# Altium project NDS_TV_OUT_V1I2.PrjPcb
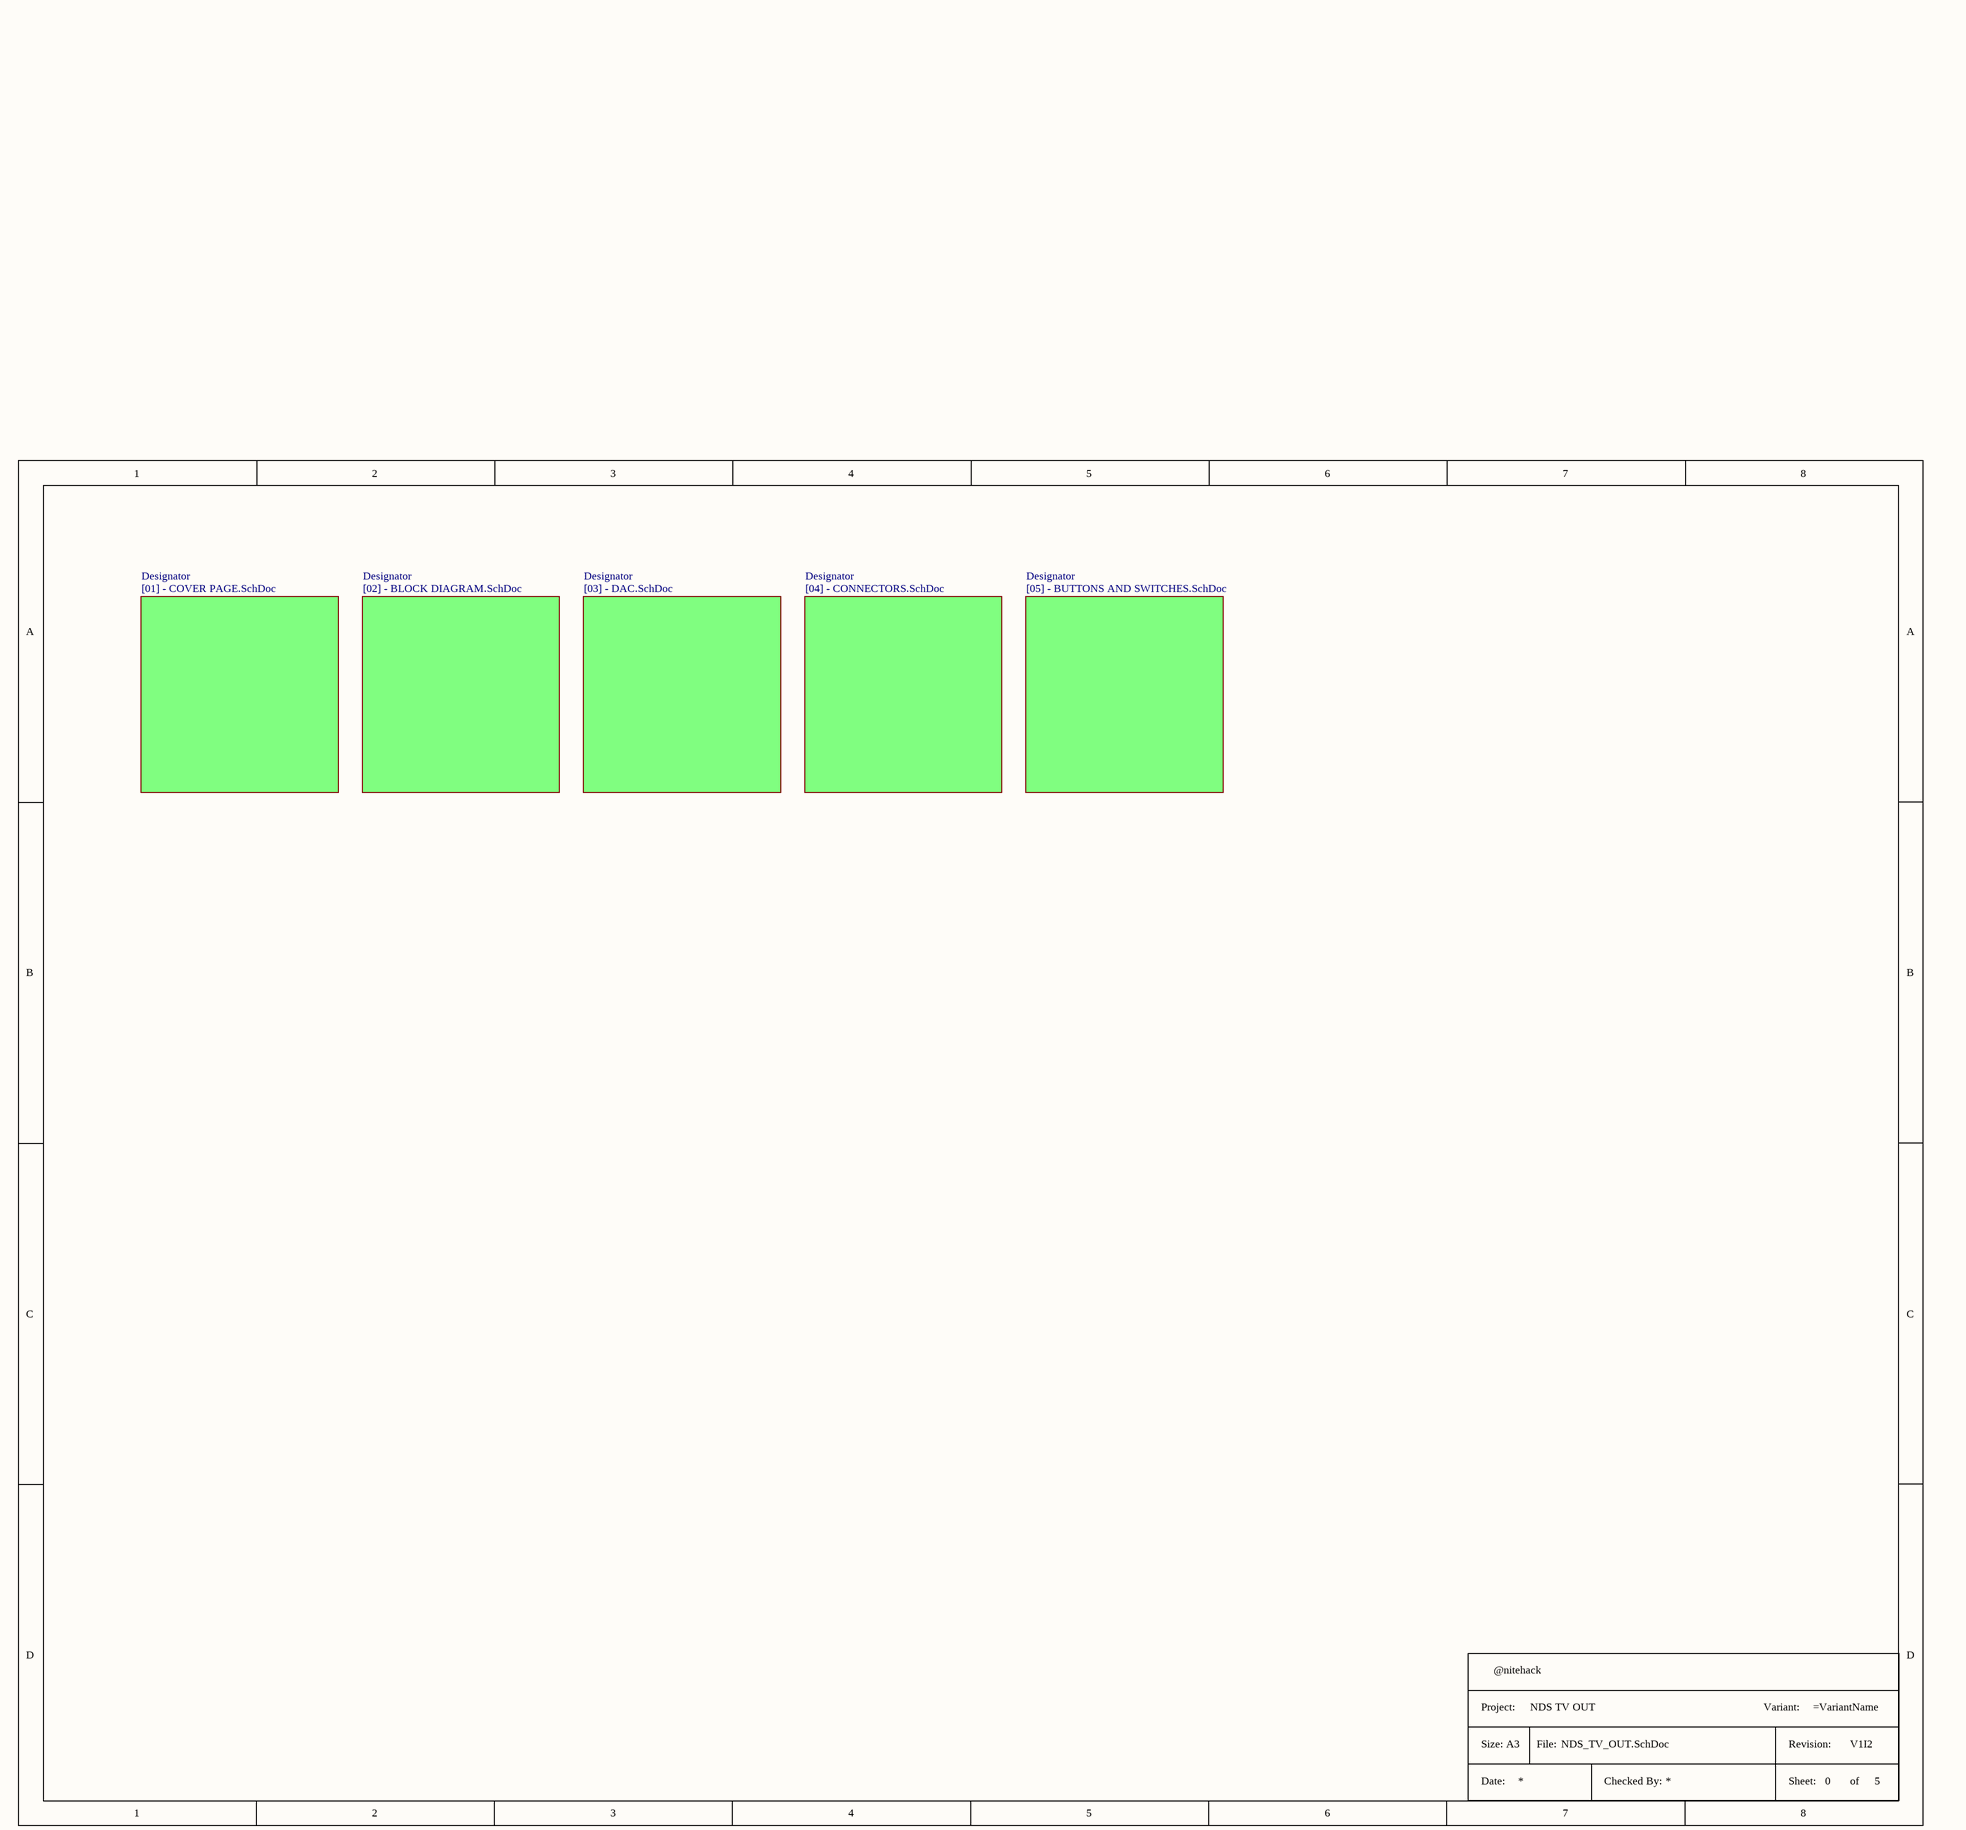
[diagram p0: NDS_TV_OUT.SchDoc]
Year: 2021; VersionRevision: V1I2; Project: NDS TV OUT; Company: @nitehack
6 sheets, 50 parts. Net scope: flat (ports and power ports of the same name join across sheets).
Board file: NDS_TV_OUT_PCB_V1I2.PcbDoc
Sheets:
  NDS_TV_OUT.SchDoc
    Designator = [01] - COVER PAGE.SchDoc
    Designator = [02] - BLOCK DIAGRAM.SchDoc
    Designator = [03] - DAC.SchDoc
    Designator = [04] - CONNECTORS.SchDoc
    Designator = [05] - BUTTONS AND SWITCHES.SchDoc

## Sheet NDS_TV_OUT.SchDoc
size A3; CompanyName: KDS; Organization: KDS; DocumentNumber: 0; Revision: V1I1; SheetNumber: 0; SheetTotal: 5; PageSetup: Record=PageOptions|CenterHorizontal=True|CenterVertical=True|PrintScale=1.07|XCorrection=1.00|YCorrection=1.00|PrintKind=1|BorderSize=5000000|LeftOffset=0|BottomOffset=0|Orientation=2|PaperLength=1000|PaperWidth=1000|Scale=100|PaperSource=7|PrintQuality=600|MediaType=1|DitherType=10|PaperKind=A3|PrintScaleMode=1; ProjectName: KDS C6A816x Module

### Parts
(Parts that share a designator on the sheet are numbered #1, #2 ... from top to bottom, then left to right.)
*#1  Title Block A3  (value not drawn)  (graphical)

### Sub-sheets
Designator = [01] - COVER PAGE.SchDoc: no entries
Designator = [02] - BLOCK DIAGRAM.SchDoc: no entries
Designator = [03] - DAC.SchDoc: no entries
Designator = [04] - CONNECTORS.SchDoc: no entries
Designator = [05] - BUTTONS AND SWITCHES.SchDoc: no entries

### Notes on the sheet
- (in symbol Title Block A3) Project:; Variant:; Size: A3; File:; Revision:; Date:; Checked By:; Sheet:; of

## Sheet [01] - COVER PAGE.SchDoc
size A3; DocumentNumber: 1; SheetNumber: 1; SheetTotal: 5
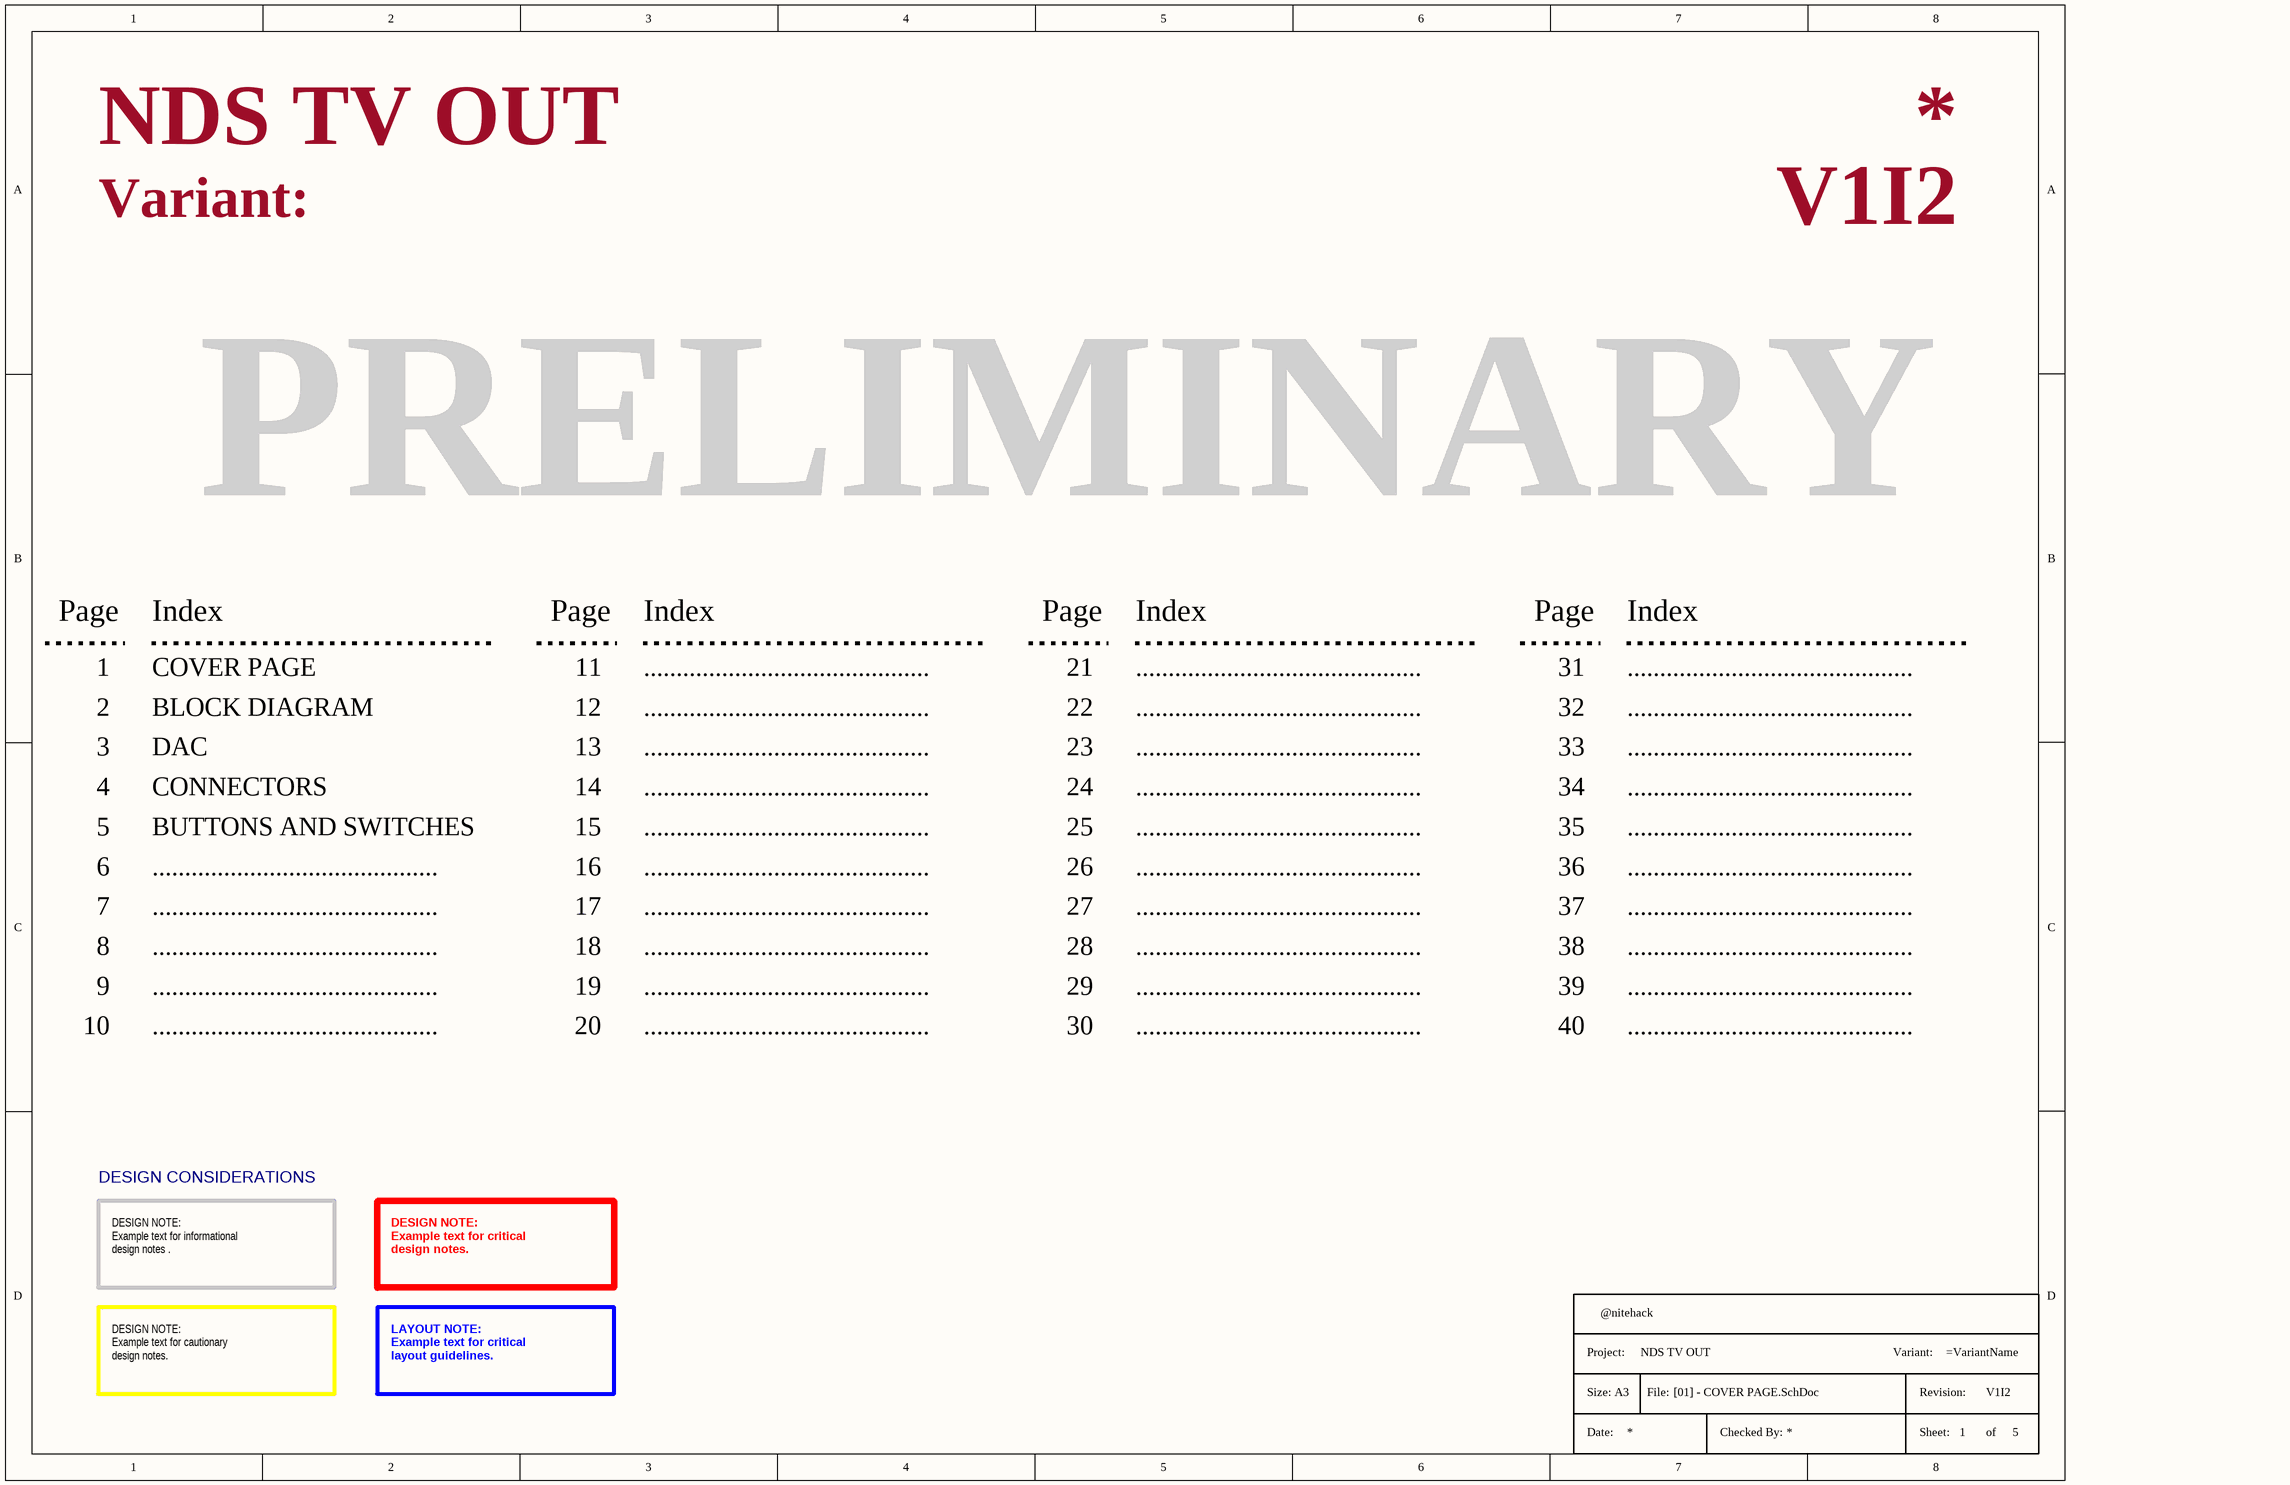
[diagram p1: [01] - COVER PAGE.SchDoc]

### Parts
(Parts that share a designator on the sheet are numbered #1, #2 ... from top to bottom, then left to right.)
*#2  Title Block A3  (value not drawn)  (graphical)

### Notes on the sheet
- Variant:
- PRELIMINARY
- Page
- Index
- 1
- COVER PAGE
- 11
- ............................................
- 21
- 31
- 2
- 3
- BLOCK DIAGRAM
- DAC
- 12
- 13
- 22
- 23
- 32
- 33
- 4
- 5
- CONNECTORS
- BUTTONS AND SWITCHES
- 14
- 15
- 24
- 25
- 34
- 35
- 6
- 16
- 26
- 36
- 7
- 8
- 17
- 18
- 27
- 28
- 37
- 38
- 9
- 10
- 19
- 20
- 29
- 30
- 39
- 40
- DESIGN CONSIDERATIONS
- DESIGN NOTE:
  Example text for informational
  design notes .
- DESIGN NOTE:
  Example text for critical
  design notes.
- DESIGN NOTE:
  Example text for cautionary
  design notes.
- LAYOUT NOTE:
  Example text for critical
  layout guidelines.
- (in symbol Title Block A3) Project:; Variant:; Size: A3; File:; Revision:; Date:; Checked By:; Sheet:; of

## Sheet [02] - BLOCK DIAGRAM.SchDoc
size A3; DocumentNumber: 2; SheetNumber: 2; SheetTotal: 5
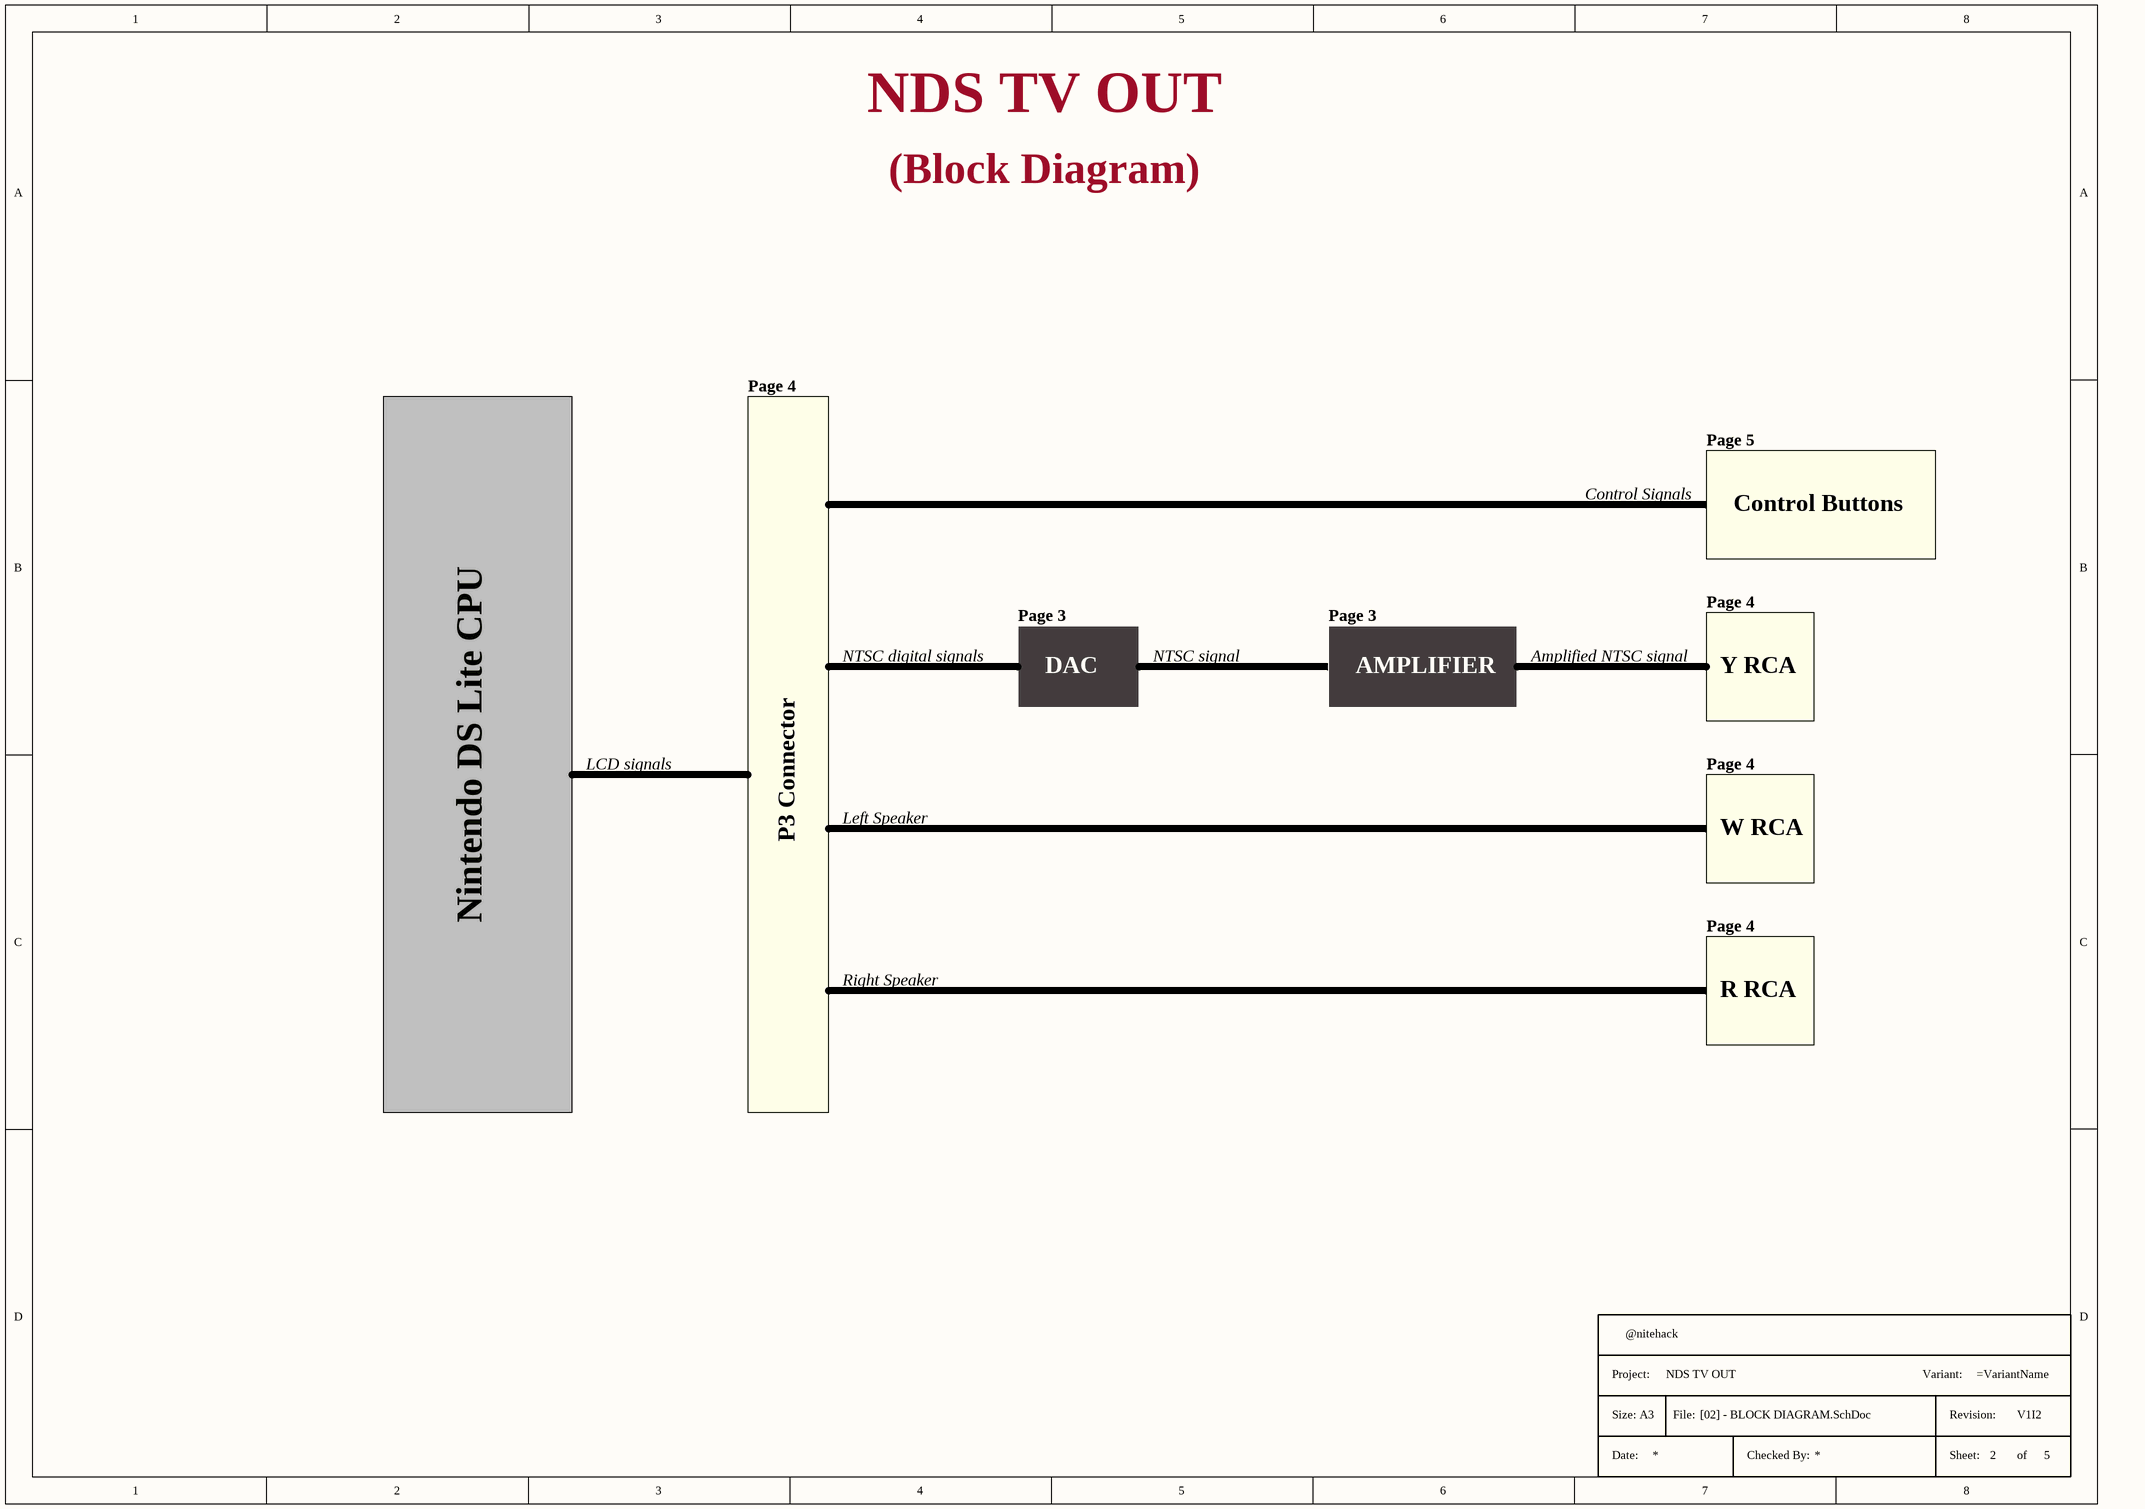
[diagram p2: [02] - BLOCK DIAGRAM.SchDoc]

### Parts
(Parts that share a designator on the sheet are numbered #1, #2 ... from top to bottom, then left to right.)
*#3  Title Block A3  (value not drawn)  (graphical)

### Notes on the sheet
- (Block Diagram)
- Page 4
- Page 5
- Control Signals
- Control Buttons
- Page 3
- NTSC digital signals
- DAC
- NTSC signal
- AMPLIFIER
- Amplified NTSC signal
- Y RCA
- LCD signals
- P3 Connector
- Left Speaker
- W RCA
- Nintendo DS Lite CPU
- Right Speaker
- R RCA
- CLOCKS (CPU & PCIE)
- (in symbol Title Block A3) Project:; Variant:; Size: A3; File:; Revision:; Date:; Checked By:; Sheet:; of

## Sheet [03] - DAC.SchDoc
size A4; DocumentNumber: 3; SheetNumber: 3; SheetTotal: 5
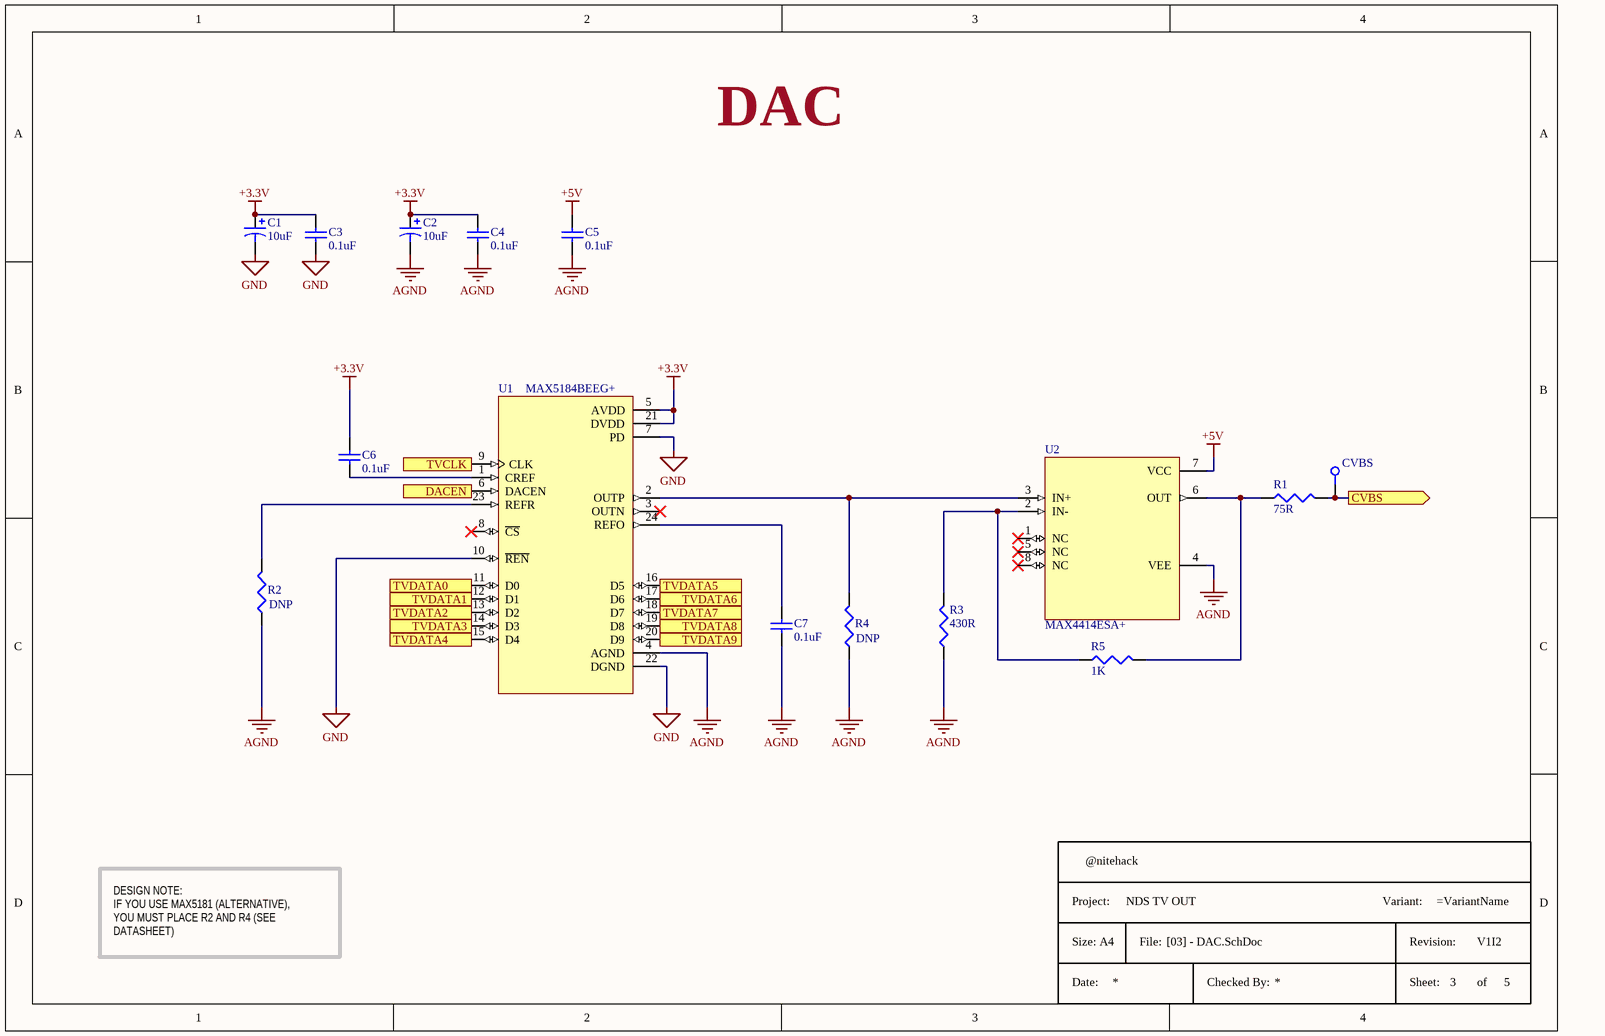
[diagram p3: [03] - DAC.SchDoc]

### Parts
(Parts that share a designator on the sheet are numbered #1, #2 ... from top to bottom, then left to right.)
*#4  Title Block A4  (value not drawn)  (graphical)
C1  10uF  [C1206T]
C2  10uF  [C1206T]
C3  0.1uF  [C1206]
C4  0.1uF  [C1206]
C5  0.1uF  [C1206]
C6  0.1uF  [C1206]
C7  0.1uF  [C1206]
CVBS  TP_25MILC  [TP_25C]  (value not drawn)  (no BOM)
R1  75R  [R0603]
R2  DNP  [R0603]
R3  430R  [R0603]
R4  DNP  [R0603]
R5  1K  [R0603]
U1  MAX5184BEEG+  [SOP63P602X175-24N]
U2  MAX4414ESA+  [SOIC127P600X175-8N]

### Ports
CVBS (out), DACEN (in), TVCLK (in), TVDATA0 (in), TVDATA1 (in), TVDATA2 (in), TVDATA3 (in), TVDATA4 (in), TVDATA5 (in), TVDATA6 (in), TVDATA7 (in), TVDATA8 (in), TVDATA9 (in)

### Nets
+3.3V: C1.1 C2.1 C3.2 C4.2 C6.1 U1.5(AVDD) U1.21(DVDD)
+5V: C5.2 U2.7(VCC)
AGND: C2.2 C4.1 C5.1 C7.1 R2.1 R3.1 R4.1 U1.4(AGND) U2.4(VEE)
GND: C1.2 C3.1 U1.7(PD) U1.10(~{REN}) U1.22(DGND)
TVCLK: U1.9(CLK) ; port TVCLK
TVDATA0: U1.11(D0) ; port TVDATA0
TVDATA1: U1.12(D1) ; port TVDATA1
TVDATA2: U1.13(D2) ; port TVDATA2
TVDATA3: U1.14(D3) ; port TVDATA3
TVDATA4: U1.15(D4) ; port TVDATA4
TVDATA5: U1.16(D5) ; port TVDATA5
TVDATA6: U1.17(D6) ; port TVDATA6
TVDATA7: U1.18(D7) ; port TVDATA7
TVDATA8: U1.19(D8) ; port TVDATA8
TVDATA9: U1.20(D9) ; port TVDATA9
NetC6_2: C6.2 U1.1(CREF)
NetC7_2: C7.2 U1.24(REFO)
NetCVBS_1: CVBS.1 R1.2 ; port CVBS
NetR1_1: R1.1 R5.2 U2.6(OUT)
NetR2_2: R2.2 U1.23(REFR)
NetR3_2: R3.2 R5.1 U2.2(IN-)
NetR4_2: R4.2 U1.2(OUTP) U2.3(IN+)
NetR6_2: U1.6(DACEN) ; port DACEN

Not connected (* = marked no-connect by the designer): U1 3(OUTN)* 8(~{CS})*; U2 1(NC)* 5(NC)* 8(NC)*

### Notes on the sheet
- DAC
- DESIGN NOTE:
  IF YOU USE MAX5181 (ALTERNATIVE), YOU MUST PLACE R2 AND R4 (SEE DATASHEET)
- (in symbol Title Block A4) Project:; Variant:; Size: A4; File:; Revision:; Date:; Checked By:; Sheet:; of

### Library data of the parts
C1 C2 = T491A106K010AT: CAPACITOR, CASE A, 10UF, 10V; Product Range:KEMET - T491 Series; Capacitance:10µF; Capacitance Tolerance:± 10%; Voltage Rating:10V; Capacitor Case Style:1206 [3216 Metric]; Manufacturer Size Code:A; Operating Temperature Max:125°C; ;RoHS Compliant: Yes; Manufacturer: KEMET; Dielectric Material: Tantalum; ESR (Equivalent Series Resistance): 4R; Life (Hours): 2000Hour; Polarity: Polar; Dissipation Factor: 6%; Leakage Current: 1uA; Ripple Current: 137mA; Supplier 1: Mouser; Manufacturer Part Number: T491A106K010AT; RoHS: Yes; Category: Tantalum Capacitors; Pricing 1: 1=0,33000, 10=0,16200, 50=0,16200, 100=0,13900, 1000=0,08800, 10000=0,06100 (USD); Mount: Surface Mount,PCB; Case/Package: 1206; Case Code (Metric): 3216; Case Code (Imperial): 1206; Min Operating Temperature: -55°C; Max Operating Temperature: 125°C; Capacitance: 10uF; Tolerance: 10%; Packaging: Tape and Reel; Voltage Rating: 10V; Features: General Purpose; Package Quantity: 2000; Termination: SMD/SMT; Voltage Rating (DC): 10V; Voltage: 10V; Length: 3.2mm; Width: 0.063inch; Height: 1.6mm; Depth: 1.6mm; Height - Seated (Max): 0.071inch; Lead Free: Lead Free; REACH SVHC: No SVHC; ComponentLink1URL: https://datasheet.ciiva.com/257/kem-t2005-t491-257584.pdf?src-supplier=Digi-Key; ComponentLink1Description: https://datasheet.ciiva.com/257/kem-t2005-t491-257584.pdf?src-supplier=Digi-Key; ComponentLink2URL: https://datasheet.ciiva.com/11793/0900766b80718482-11793106.pdf?src-supplier=RSComponents; ComponentLink2Description: https://datasheet.ciiva.com/11793/0900766b80718482-11793106.pdf?src-supplier=RSComponents; ComponentLink3URL: https://datasheet.ciiva.com/7668/1732743-7668006.pdf?src-supplier=Element14; ComponentLink3Description: https://datasheet.ciiva.com/7668/1732743-7668006.pdf?src-supplier=Element14; ComponentLink4URL: https://datasheet.ciiva.com/20171/458293-da-en-01-20171903.pdf?src-supplier=Rapid+Electronics; ComponentLink4Description: https://datasheet.ciiva.com/20171/458293-da-en-01-20171903.pdf?src-supplier=Rapid+Electronics; ComponentLink5URL: https://datasheet.ciiva.com/27052/1573249-27052559.pdf?src-supplier=Jameco; ComponentLink5Description: https://datasheet.ciiva.com/27052/1573249-27052559.pdf?src-supplier=Jameco; ComponentLink6URL: https://datasheet.ciiva.com/257/kem-t2005-t491-257585.pdf?src-supplier=Digi-Key; ComponentLink6Description: https://datasheet.ciiva.com/257/kem-t2005-t491-257585.pdf?src-supplier=Digi-Key; ComponentLink7URL: https://datasheet.ciiva.com/257/kem-t2005-t491-257586.pdf?src-supplier=Digi-Key; ComponentLink7Description: https://datasheet.ciiva.com/257/kem-t2005-t491-257586.pdf?src-supplier=Digi-Key; ComponentLink8URL: https://datasheet.ciiva.com/7668/1854511-7668005.pdf?src-supplier=Element14; ComponentLink8Description: https://datasheet.ciiva.com/7668/1854511-7668005.pdf?src-supplier=Element14; ComponentLink9URL: https://datasheet.ciiva.com/7668/1854511-7668007.pdf?src-supplier=Element14; ComponentLink9Description: https://datasheet.ciiva.com/7668/1854511-7668007.pdf?src-supplier=Element14; ComponentLink10URL: https://datasheet.ciiva.com/7668/1446014-7668008.pdf?src-supplier=Element14; ComponentLink10Description: https://datasheet.ciiva.com/7668/1446014-7668008.pdf?src-supplier=Element14; ComponentLink11URL: https://datasheet.ciiva.com/12882/kem-t2005-t491-12882826.pdf?src-supplier=Mouser; ComponentLink11Description: https://datasheet.ciiva.com/12882/kem-t2005-t491-12882826.pdf?src-supplier=Mouser; ComponentLink12URL: https://datasheet.ciiva.com/7668/kem-t2005-t491-7668139.pdf?src-supplier=Element14; ComponentLink12Description: https://datasheet.ciiva.com/7668/kem-t2005-t491-7668139.pdf?src-supplier=Element14; ComponentLink13URL: https://datasheet.ciiva.com/14586/70095774-14586699.pdf?src-supplier=Allied+Electronics; ComponentLink13Description: https://datasheet.ciiva.com/14586/70095774-14586699.pdf?src-supplier=Allied+Electronics; ComponentLink14URL: https://datasheet.ciiva.com/14596/70095774-14596972.pdf?src-supplier=Allied+Electronics; ComponentLink14Description: https://datasheet.ciiva.com/14596/70095774-14596972.pdf?src-supplier=Allied+Electronics; ComponentLink15URL: https://datasheet.ciiva.com/29244/458293-da-01-en-kondensator-10uf-3216-10pr-10v-85c-29244583.pdf?src-supplier=Conrad; ComponentLink15Description: https://datasheet.ciiva.com/29244/458293-da-01-en-kondensator-10uf-3216-10pr-10v-85c-29244583.pdf?src-supplier=Conrad; Supplier Part Number 1: 80-T491A106K010
C3-C7 = GRM319R71H104KA01D: MURATA - GRM319R71H104KA01D - COND, CERÁ MULT, X7R, 100NF, 50V, 1206; Supplier 1: Farnell; Manufacturer: MURATA; Manufacturer Part Number: GRM319R71H104KA01D; RoHS: YES; Stock 1: 24194; Pricing 1: 10=0,0548, 100=0,0373, 500=0,0298, 1000=0,0271, 2000=0,0248, 4000=0,0231, 20000=0,0213, 40000=0,0209 (EUR); ComponentLink1URL: http://www.farnell.com/datasheets/2048709.pdf; ComponentLink1Description: http://www.farnell.com/datasheets/2048709.pdf; ComponentLink2URL: http://www.farnell.com/datasheets/2006461.pdf; ComponentLink2Description: http://www.farnell.com/datasheets/2006461.pdf; Supplier 2: Digi-Key; Supplier Part Number 1: 1828956; Supplier Part Number 2: 490-1775-1-ND
CVBS = TP_25MILC: Test Point 25mil
R1 = CRCW060375R0FKEA: VISHAY - CRCW060375R0FKEA - RES, 75R, 1%, 0.1W, 0603, THICK FILM; Power Rating: 100mW; Temperature Coefficient: 100ppm/°C; Voltage Rating: 75V; Supplier 1: Mouser; Manufacturer: Vishay; Manufacturer Part Number: CRCW060375R0FKEA; RoHS: Yes; Category: Chip SMD Resistors; Stock 1: 107137; Pricing 1: 1=0,10000, 10=0,03100, 50=0,03100, 100=0,01300, 1000=0,00500, 10000=0,00500 (USD); Case/Package: 0603; Contact Plating: Tin; Weight: 7.1E-05oz; Case Code (Imperial): 0603; Case Code (Metric): 1608; Min Operating Temperature: -55°C; Max Operating Temperature: 155°C; Resistance: 75R; Tolerance: 1%; Resistor Type: Thick Film; Packaging: Tape and Reel; Package Quantity: 5000; Termination: SMD/SMT; Number of Terminations: 2; Voltage Rating (DC): 75V; Working Voltage: 75V; Length: 1.55mm; Width: 0.85mm; Height: 0.45mm; Depth: 0.85mm; Lead Free: Lead Free; REACH SVHC: Unknown; Military Standard: Not; ComponentLink1URL: https://datasheet.ciiva.com/11809/0900766b80d98afc-11809100.pdf?src-supplier=RSComponents; ComponentLink1Description: https://datasheet.ciiva.com/11809/0900766b80d98afc-11809100.pdf?src-supplier=RSComponents; ComponentLink2URL: https://datasheet.ciiva.com/16199/dcrcwe3-16199141.pdf?src-supplier=Future+Electronics; ComponentLink2Description: https://datasheet.ciiva.com/16199/dcrcwe3-16199141.pdf?src-supplier=Future+Electronics; ComponentLink3URL: https://datasheet.ciiva.com/5541/dcrcwe3-109170-5541910.pdf?src-supplier=Mouser; ComponentLink3Description: https://datasheet.ciiva.com/5541/dcrcwe3-109170-5541910.pdf?src-supplier=Mouser; ComponentLink4URL: https://datasheet.ciiva.com/16722/70201119-16722522.pdf?src-supplier=Allied+Electronics; ComponentLink4Description: https://datasheet.ciiva.com/16722/70201119-16722522.pdf?src-supplier=Allied+Electronics; ComponentLink5URL: https://datasheet.ciiva.com/7673/1697337-7673323.pdf?src-supplier=Element14; ComponentLink5Description: https://datasheet.ciiva.com/7673/1697337-7673323.pdf?src-supplier=Element14; ComponentLink6URL: https://datasheet.ciiva.com/16852/dcrcwe3-16852747.pdf?src-supplier=Avnet+Europe; ComponentLink6Description: https://datasheet.ciiva.com/16852/dcrcwe3-16852747.pdf?src-supplier=Avnet+Europe; ComponentLink7URL: https://datasheet.ciiva.com/3257/dcrcwe3-3257884.pdf?src-supplier=Avnet; ComponentLink7Description: https://datasheet.ciiva.com/3257/dcrcwe3-3257884.pdf?src-supplier=Avnet; ComponentLink8URL: https://datasheet.ciiva.com/3257/dcrcwe3-3257885.pdf?src-supplier=Avnet; ComponentLink8Description: https://datasheet.ciiva.com/3257/dcrcwe3-3257885.pdf?src-supplier=Avnet; ComponentLink9URL: https://datasheet.ciiva.com/16780/70201119-16780254.pdf?src-supplier=Allied+Electronics; ComponentLink9Description: https://datasheet.ciiva.com/16780/70201119-16780254.pdf?src-supplier=Allied+Electronics; ComponentLink10URL: https://datasheet.ciiva.com/7673/1697337-7673471.pdf?src-supplier=Element14; ComponentLink10Description: https://datasheet.ciiva.com/7673/1697337-7673471.pdf?src-supplier=Element14; Supplier Part Number 1: 71-CRCW0603-75-E3
R2 R4 = R0603
R3 = MCWF06R4300BTL: Res, 430R, 0.1%, 0.1W, 0603, Thin Film; Manufacturer: Multicomp; Voltage Rating (DC): 75V; Temperature Coefficient: 25ppm/°C; Power Rating: 100mW; Supplier 1: Farnell; Manufacturer Part Number: MCWF06R4300BTL; RoHS: No; Stock 1: 14065; Pricing 1: 10=0,10600, 100=0,06130, 500=0,04660, 1000=0,04090, 2500=0,03490, 5000=0,02950, 25000=0,02460, 50000=0,02090 (EUR); Case Code (Imperial): 0603; Case Code (Metric): 1608; Tolerance: 0.1%; Resistance: 430R; Voltage Rating: 75V; Packaging: Cut Tape; Resistor Type: Thin Film; REACH SVHC: No SVHC; ComponentLink1URL: http://www.farnell.com/datasheets/1729042.pdf?src-supplier=Element14; ComponentLink1Description: http://www.farnell.com/datasheets/1729042.pdf?src-supplier=Element14; ComponentLink2URL: http://www.farnell.com/datasheets/1729040.pdf?src-supplier=Element14; ComponentLink2Description: http://www.farnell.com/datasheets/1729040.pdf?src-supplier=Element14; Supplier Part Number 1: 2337178
R5 = ESR03EZPF1001: ROHM - ESR03EZPF1001 - SMD Chip Resistor, Anti-Surge, 0603 [1608 Metric], 1 kohm, ESR Series, 150 V, Thick Film, 250 mW; Temperature Coefficient: 100ppm/°C; Max Power Dissipation: 250mW; Resistance: 1kR; Tolerance: 1%; Supplier 1: Mouser; Manufacturer: Rohm; Manufacturer Part Number: ESR03EZPF1001; RoHS: Yes; Category: Chip SMD Resistors; Stock 1: 87852; Pricing 1: 1=0,13000, 10=0,11100, 50=0,11100, 100=0,04400, 1000=0,01700, 10000=0,01100 (USD); Case/Package: 0603; Case Code (Metric): 1608; Case Code (Imperial): 0603; Min Operating Temperature: -55°C; Max Operating Temperature: 155°C; Resistor Type: Thick Film; Number of Terminations: 2; Features: Automotive AEC-Q200; Package Quantity: 1; Power Rating: 250mW; Packaging: Tape and Reel; Length: 0.063inch; Width: 0.031inch; Height: 0.022inch; Lead Free: Lead Free; ComponentLink1URL: https://datasheet.ciiva.com/2469/esr-2469712.pdf?src-supplier=Digi-Key; ComponentLink1Description: https://datasheet.ciiva.com/2469/esr-2469712.pdf?src-supplier=Digi-Key; ComponentLink2URL: https://datasheet.ciiva.com/2469/esr-2469713.pdf?src-supplier=Digi-Key; ComponentLink2Description: https://datasheet.ciiva.com/2469/esr-2469713.pdf?src-supplier=Digi-Key; ComponentLink3URL: https://datasheet.ciiva.com/2469/esr-2469714.pdf?src-supplier=Digi-Key; ComponentLink3Description: https://datasheet.ciiva.com/2469/esr-2469714.pdf?src-supplier=Digi-Key; Supplier Part Number 1: 755-ESR03EZPF1001
U1 = MAX5184BEEG+: DAC 1-CH Current Steering 10-bit 24-Pin QSOP; Manufacturer: Maxim; Integral Nonlinearity (INL): 2LSB; Full Scale Error: 40LSB; Resolution: 10b; Output Type: Voltage; Interface: Parallel; Supply Type: Analog,Digital; Number of Converters: 1; Settling Time: 25us; Number of Bits: 10; Max Supply Voltage: 3.3V; Min Supply Voltage: 2.7V; Supplier 1: Farnell; Manufacturer Part Number: MAX5184BEEG+; RoHS: Yes; Category: Digital to Analog Converters (DACs); Stock 1: 67; Pricing 1: 1=4,14000, 10=3,73000, 25=3,57000, 50=3,46000, 100=3,38000, 250=3,31000, 500=3,23000 (EUR); Mount: Surface Mount; Case/Package: QSOP; Number of Pins: 24; Min Operating Temperature: -40°C; Max Operating Temperature: 85°C; Packaging: Rail/Tube; Package Quantity: 50; Number of DAC Channels: 1; Radiation Hardening: No; REACH SVHC: No SVHC; ComponentLink1URL: https://datasheet.ciiva.com/7657/37859-7657051.pdf?src-supplier=Element14; ComponentLink1Description: https://datasheet.ciiva.com/7657/37859-7657051.pdf?src-supplier=Element14; ComponentLink2URL: https://datasheet.ciiva.com/26802/max5184beeg-26802205.pdf?src-supplier=IIIC; ComponentLink2Description: https://datasheet.ciiva.com/26802/max5184beeg-26802205.pdf?src-supplier=IIIC; ComponentLink3URL: https://datasheet.ciiva.com/1369/max5181-max5184-1369083.pdf?src-supplier=Digi-Key; ComponentLink3Description: https://datasheet.ciiva.com/1369/max5181-max5184-1369083.pdf?src-supplier=Digi-Key; ComponentLink4URL: https://datasheet.ciiva.com/14250/max5181-max5184-14250750.pdf?src-supplier=Avnet; ComponentLink4Description: https://datasheet.ciiva.com/14250/max5181-max5184-14250750.pdf?src-supplier=Avnet; Supplier Part Number 1: 2514736
U2 = MAX4414ESA+: IC OPAMP VFB 400MHZ RRO 8SOIC; Manufacturer: Maxim; Min Supply Voltage: 2.7V; Max Supply Voltage: 5.5V; Voltage Gain: 80dB; Common Mode Rejection Ratio: 65dB; Slew Rate: 200V/µs; Input Offset Voltage (Vos): 500uV; Operating Supply Current: 1.6mA; Number of Channels: 1; Output Current per Channel: 75mA; Input Bias Current: 1.3uA; Max Power Dissipation: 471mW; Power Supply Rejection Ratio (PSRR): 77dB; Supplier 1: Avnet; Manufacturer Part Number: MAX4414ESA+; RoHS: Yes; Category: Amplifiers - Op Amps, Buffer, Instrumentation; Stock 1: 26813; Pricing 1: 200=2,46210, 400=2,42730, 600=2,39250, 1000=2,35770, 2000=2,32290, 10000=2,28810, 20000=2,25330 (USD); Mount: Surface Mount; Case/Package: SOIC; Number of Pins: 8; Min Operating Temperature: -40°C; Max Operating Temperature: 85°C; Packaging: Rail/Tube; -3db Bandwidth: 400MHz; Gain Bandwidth Product: 400MHz; Number of Circuits: 1; Series: MAX4414; Package Quantity: 100; Nominal Supply Current: 1.6mA; Output Current: 75mA; Bandwidth: 400MHz; Number of Amplifiers: 1; Supply Current: 1.6mA; Radiation Hardening: No; RoHS Compliant: Yes; REACH SVHC: Unknown; ComponentLink1URL: https://datasheet.ciiva.com/1819/max4414-max4419-1819941.pdf?src-supplier=Digi-Key; ComponentLink1Description: https://datasheet.ciiva.com/1819/max4414-max4419-1819941.pdf?src-supplier=Digi-Key; Supplier Part Number 1: MAX4414ESA+

## Sheet [04] - CONNECTORS.SchDoc
size A4; DocumentNumber: 4; SheetNumber: 4; SheetTotal: 5
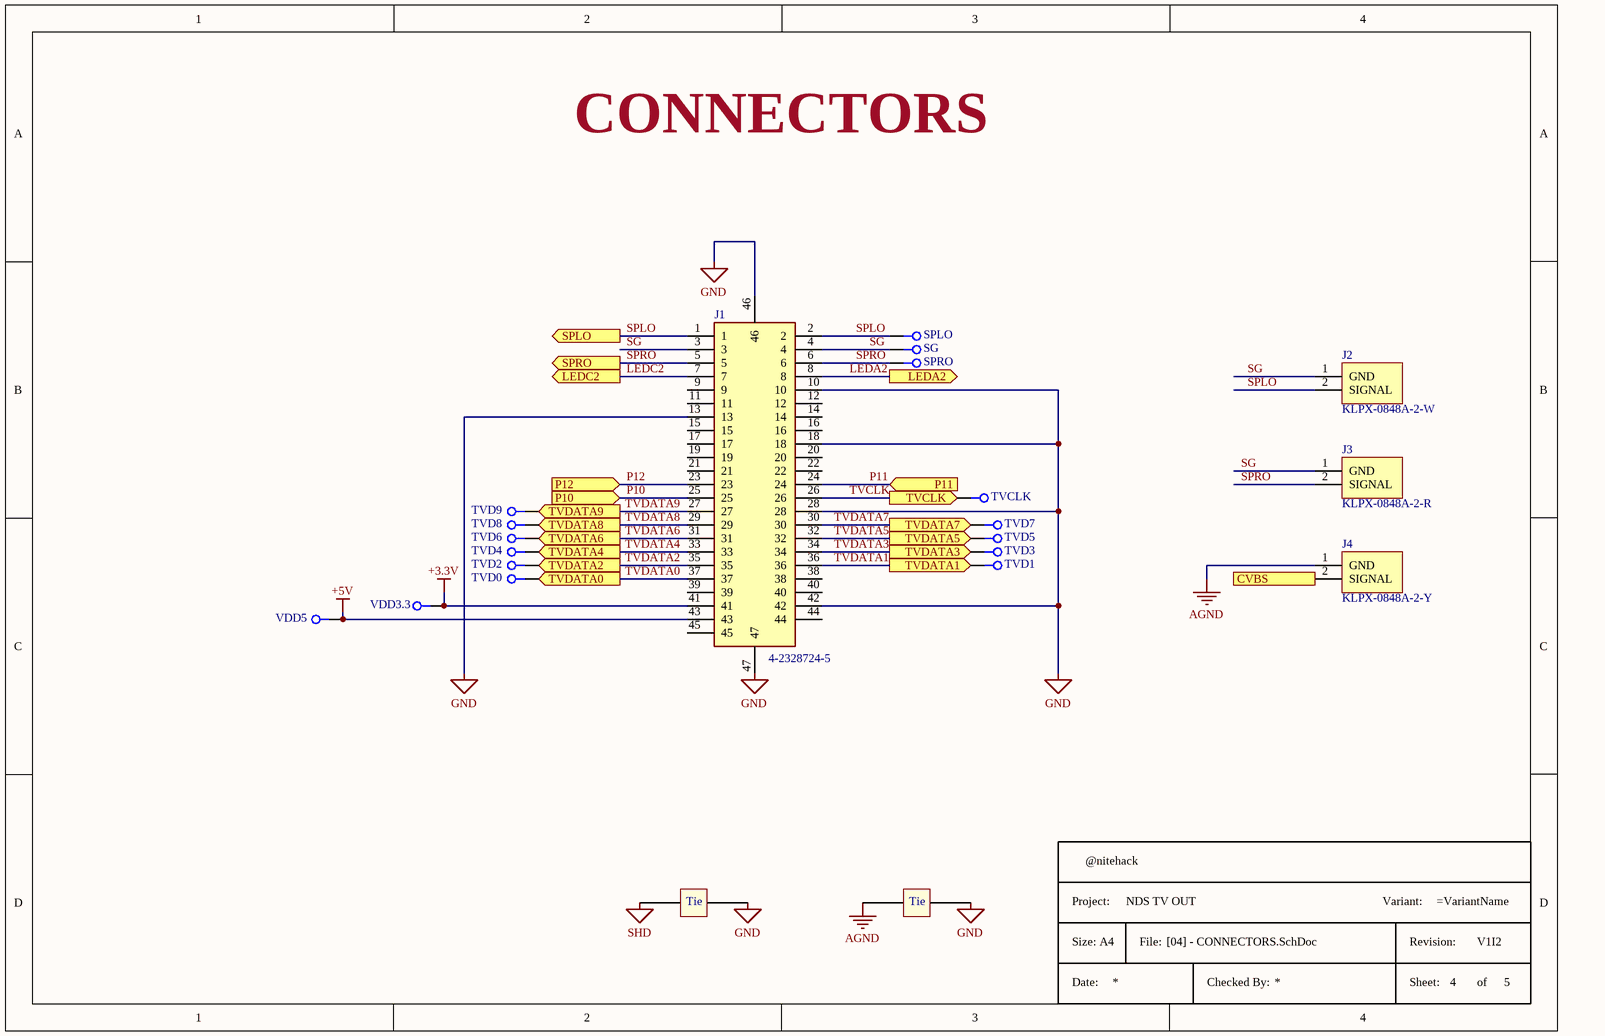
[diagram p4: [04] - CONNECTORS.SchDoc]

### Parts
(Parts that share a designator on the sheet are numbered #1, #2 ... from top to bottom, then left to right.)
*#5  Title Block A4  (value not drawn)  (graphical)
J1  4-2328724-5  [423287245]
J2  KLPX-0848A-2-W  [KLPX0848A2W]
J3  KLPX-0848A-2-R  [KLPX0848A2R]
J4  KLPX-0848A-2-Y  [KLPX0848A2Y]
SG  TP_25MILC  [TP_25C]  (value not drawn)  (no BOM)
SPLO  TP_25MILC  [TP_25C]  (value not drawn)  (no BOM)
SPRO  TP_25MILC  [TP_25C]  (value not drawn)  (no BOM)
T1  NET TIE  [NET_TIE]  (value not drawn)  (net tie, no BOM)
T2  NET TIE  [NET_TIE]  (value not drawn)  (net tie, no BOM)
TVCLK  TP_25MILC  [TP_25C]  (value not drawn)  (no BOM)
TVD0  TP_25MILC  [TP_25C]  (value not drawn)  (no BOM)
TVD1  TP_25MILC  [TP_25C]  (value not drawn)  (no BOM)
TVD2  TP_25MILC  [TP_25C]  (value not drawn)  (no BOM)
TVD3  TP_25MILC  [TP_25C]  (value not drawn)  (no BOM)
TVD4  TP_25MILC  [TP_25C]  (value not drawn)  (no BOM)
TVD5  TP_25MILC  [TP_25C]  (value not drawn)  (no BOM)
TVD6  TP_25MILC  [TP_25C]  (value not drawn)  (no BOM)
TVD7  TP_25MILC  [TP_25C]  (value not drawn)  (no BOM)
TVD8  TP_25MILC  [TP_25C]  (value not drawn)  (no BOM)
TVD9  TP_25MILC  [TP_25C]  (value not drawn)  (no BOM)
VDD3.3  TP_25MILC  [TP_25C]  (value not drawn)  (no BOM)
VDD5  TP_25MILC  [TP_25C]  (value not drawn)  (no BOM)

### Ports
CVBS (in), LEDA2 (out), LEDC2 (out), P10 (in), P11 (in), P12 (in), SPLO (out), SPRO (out), TVCLK (out), TVDATA0 (out), TVDATA1 (out), TVDATA2 (out), TVDATA3 (out), TVDATA4 (out), TVDATA5 (out), TVDATA6 (out), TVDATA7 (out), TVDATA8 (out), TVDATA9 (out)

### Nets
+3.3V: J1.41 VDD3.3.1
+5V: J1.43 VDD5.1
AGND: J4.1(GND) T1.1
GND: J1.10 J1.13 J1.18 J1.28 J1.42 J1.46 J1.47 T1.2 T2.2
SHD: T2.1
LEDA2: J1.8 ; port LEDA2
LEDC2: J1.7 ; port LEDC2
P10: J1.25 ; port P10
P11: J1.24 ; port P11
P12: J1.23 ; port P12
SG: J1.3 J1.4 J2.1(GND) J3.1(GND) SG.1
SPLO: J1.1 J1.2 J2.2(SIGNAL) SPLO.1 ; port SPLO
SPRO: J1.5 J1.6 J3.2(SIGNAL) SPRO.1 ; port SPRO
TVCLK: J1.26 TVCLK.1 ; port TVCLK
TVDATA0: J1.37 TVD0.1 ; port TVDATA0
TVDATA1: J1.36 TVD1.1 ; port TVDATA1
TVDATA2: J1.35 TVD2.1 ; port TVDATA2
TVDATA3: J1.34 TVD3.1 ; port TVDATA3
TVDATA4: J1.33 TVD4.1 ; port TVDATA4
TVDATA5: J1.32 TVD5.1 ; port TVDATA5
TVDATA6: J1.31 TVD6.1 ; port TVDATA6
TVDATA7: J1.30 TVD7.1 ; port TVDATA7
TVDATA8: J1.29 TVD8.1 ; port TVDATA8
TVDATA9: J1.27 TVD9.1 ; port TVDATA9
NetCVBS_1: J4.2(SIGNAL) ; port CVBS

Not connected (* = marked no-connect by the designer): J1 9 11 12 14 15 16 17 19 20 21 22 38 39 40 44 45

### Notes on the sheet
- CONNECTORS
- (in symbol NET_TIE) Tie
- (in symbol Title Block A4) Project:; Variant:; Size: A4; File:; Revision:; Date:; Checked By:; Sheet:; of

### Library data of the parts
J1 = 4-2328724-5: FPC Connector; 0.3mm pitch front flip FPC; 45pos; Manufacturer: TE Connectivity AMP; Actuator Material: Thermoplastic; Number of Positions: 45; Voltage Rating: 30V; Current Rating: 500mA; Supplier 1: Farnell; Manufacturer Part Number: 4-2328724-5; RoHS: No; Category: FFC / FPC; Stock 1: 408; Pricing 1: 1=0,23000, 125=0,21700, 375=0,20400, 1000=0,19100, 2500=0,18700 (EUR); Mount: Surface Mount; Contact Material: Copper Alloy; Contact Plating: Gold; Housing Material: Thermoplastic; Housing Color: Natural; Min Operating Temperature: -40°C; Max Operating Temperature: 85°C; Packaging: Tape and Reel; Termination: Solder; Flammability Rating: UL94 V-0; ComponentLink1URL: https://www.te.com/commerce/DocumentDelivery/DDEController?Action=srchrtrv&amp;DocNm=2328724&amp;DocType=Customer+Drawing&amp;DocLang=English&src-supplier=Digi-Key; ComponentLink1Description: https://www.te.com/commerce/DocumentDelivery/DDEController?Action=srchrtrv&amp;DocNm=2328724&amp;DocType=Customer+Drawing&amp;DocLang=English&src-supplier=Digi-Key; Supplier Part Number 1: 2946027
J2 = KLPX-0848A-2-W: Conn RCA F 2 POS 4.5mm Solder RA Thru-Hole 2 Terminal 1 Port; Manufacturer: Kycon; Number of Ports: 1; Gender: Female; Voltage Rating: 500V; Number of Contacts: 2; Supplier 1: Mouser; Manufacturer Part Number: KLPX-0848A-2-W; RoHS: Yes; Category: Connectors; Pricing 1: 1=0,78000, 10=0,61500, 50=0,61500, 100=0,53400, 1000=0,42700, 10000=0,34700 (USD); Mount: Through Hole; Color: White; Contact Material: Brass; Contact Plating: Tin; Termination: Through Hole; Orientation: Right Angle; Package Quantity: 500; Packaging: Bag; Pitch: 4.5mm; Radiation Hardening: No; ComponentLink1URL: http://www.mouser.com/ds/2/222/KLPX-334830.pdf?src-supplier=Mouser; ComponentLink1Description: http://www.mouser.com/ds/2/222/KLPX-334830.pdf?src-supplier=Mouser; ComponentLink2URL: http://domino2.kycon.com/catalog_PDF/Standard%20Catalog%20page/RCA%20Phono%20Jacks/SKLPX.pdf?src-supplier=Avnet; ComponentLink2Description: http://domino2.kycon.com/catalog_PDF/Standard%20Catalog%20page/RCA%20Phono%20Jacks/SKLPX.pdf?src-supplier=Avnet; ComponentLink3URL: http://domino2.kycon.com/catalog_PDF/Standard%20Catalog%20page/RCA%20Phono%20Jacks/SKLPX.pdf?src-supplier=Avnet+Europe; ComponentLink3Description: http://domino2.kycon.com/catalog_PDF/Standard%20Catalog%20page/RCA%20Phono%20Jacks/SKLPX.pdf?src-supplier=Avnet+Europe; Supplier Part Number 1: 806-KLPX-0848A-2-W
J3 = KLPX-0848A-2-R: Conn RCA F 2 POS 4.5mm Solder RA Thru-Hole 2 Terminal 1 Port; Manufacturer: Kycon; Number of Ports: 1; Gender: Female; Voltage Rating: 500V; Number of Contacts: 2; Supplier 1: Mouser; Manufacturer Part Number: KLPX-0848A-2-R; RoHS: Yes; Category: Connectors; Stock 1: 694; Pricing 1: 1=0,78000, 10=0,61500, 50=0,61500, 100=0,53400, 1000=0,42800, 10000=0,34800 (USD); Mount: Through Hole; Color: Red; Contact Material: Brass; Contact Plating: Tin; Orientation: Right Angle; Termination: Through Hole; Packaging: Bag; Package Quantity: 500; Pitch: 4.5mm; Radiation Hardening: No; ComponentLink1URL: http://www.mouser.com/ds/2/222/KLPX-334830.pdf?src-supplier=Mouser; ComponentLink1Description: http://www.mouser.com/ds/2/222/KLPX-334830.pdf?src-supplier=Mouser; ComponentLink2URL: http://domino2.kycon.com/catalog_PDF/Standard%20Catalog%20page/RCA%20Phono%20Jacks/SKLPX.pdf?src-supplier=Avnet; ComponentLink2Description: http://domino2.kycon.com/catalog_PDF/Standard%20Catalog%20page/RCA%20Phono%20Jacks/SKLPX.pdf?src-supplier=Avnet; ComponentLink3URL: http://domino2.kycon.com/catalog_PDF/Standard%20Catalog%20page/RCA%20Phono%20Jacks/SKLPX.pdf?src-supplier=Avnet+Europe; ComponentLink3Description: http://domino2.kycon.com/catalog_PDF/Standard%20Catalog%20page/RCA%20Phono%20Jacks/SKLPX.pdf?src-supplier=Avnet+Europe; Supplier Part Number 1: 806-KLPX-0848A-2-R
J4 = KLPX-0848A-2-Y: Conn RCA F 2 POS 4.5mm Solder RA Thru-Hole 2 Terminal 1 Port; Manufacturer: Kycon; Number of Ports: 1; Gender: Female; Voltage Rating: 500V; Number of Contacts: 2; Supplier 1: Mouser; Manufacturer Part Number: KLPX-0848A-2-Y; RoHS: Yes; Category: Connectors; Stock 1: 528; Pricing 1: 1=0,78000, 10=0,61500, 50=0,61500, 100=0,53400, 1000=0,42700, 10000=0,34700 (USD); Mount: Through Hole; Color: Yellow; Contact Material: Brass; Contact Plating: Tin; Termination: Through Hole; Orientation: Right Angle; Package Quantity: 500; Packaging: Bag; Pitch: 4.5mm; Radiation Hardening: No; ComponentLink1URL: https://datasheet.ciiva.com/12540/klpx-0848a-2-x-183296-12540000.pdf?src-supplier=Mouser; ComponentLink1Description: https://datasheet.ciiva.com/12540/klpx-0848a-2-x-183296-12540000.pdf?src-supplier=Mouser; Supplier Part Number 1: 806-KLPX-0848A-2-Y
SG SPLO SPRO TVCLK TVD0-TVD9 VDD3.3 VDD5 = TP_25MILC: Test Point 25mil
T1 T2 = NET_TIE: .PCBCheck: *; .SCHCheck: *

## Sheet [05] - BUTTONS AND SWITCHES.SchDoc
size A4; DocumentNumber: 5; SheetNumber: 5; SheetTotal: 5
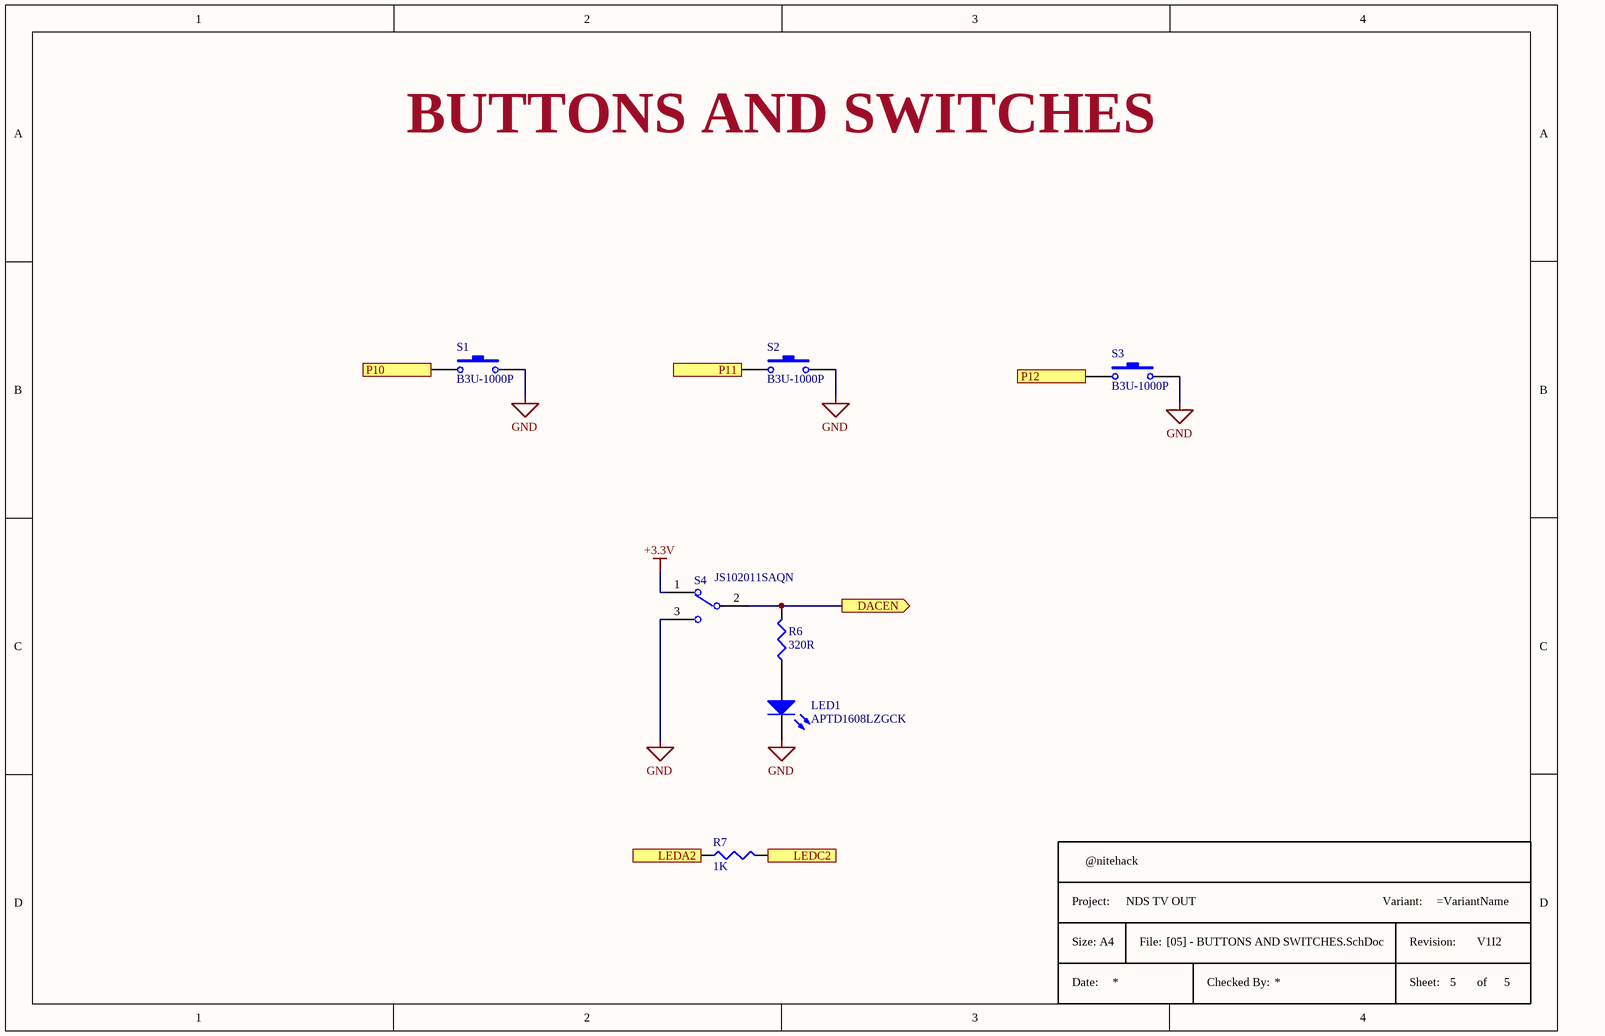
[diagram p5: [05] - BUTTONS AND SWITCHES.SchDoc]

### Parts
(Parts that share a designator on the sheet are numbered #1, #2 ... from top to bottom, then left to right.)
*#6  Title Block A4  (value not drawn)  (graphical)
LED1  APTD1608LZGCK  [RESC0603X55N]
R6  320R  [R0603]
R7  1K  [R0603]
S1  B3U-1000P  [SW_B3U-1000P]
S2  B3U-1000P  [SW_B3U-1000P]
S3  B3U-1000P  [SW_B3U-1000P]
S4  JS102011SAQN  [SW_JS102011SAQN]

### Ports
DACEN (out), LEDA2 (in), LEDC2 (in), P10 (out), P11 (out), P12 (out)

### Nets
+3.3V: S4.1
GND: LED1.1(K) S1.2 S2.2 S3.2 S4.3
LEDA2: R7.1 ; port LEDA2
LEDC2: R7.2 ; port LEDC2
P10: S1.1 ; port P10
P11: S2.1 ; port P11
P12: S3.1 ; port P12
NetLED1_2: LED1.2(A) R6.1
NetR6_2: R6.2 S4.2 ; port DACEN

### Notes on the sheet
- BUTTONS AND SWITCHES
- (in symbol Title Block A4) Project:; Variant:; Size: A4; File:; Revision:; Date:; Checked By:; Sheet:; of

### Library data of the parts
LED1 = APTD1608LZGCK: LED GREEN CLEAR 0603 SMD; Manufacturer: Kingbright; Lens Color: Colorless; Luminous Intensity: 90mcd; Test Current: 2mA; Viewing Angle: 60°; Dominant Wavelength: 525nm; Forward Voltage: 2.65V; Supplier 1: Mouser; Manufacturer Part Number: APTD1608LZGCK; RoHS: Yes; Category: LEDs; Stock 1: 24112; Pricing 1: 1=0,56000, 10=0,36300, 50=0,36300, 100=0,31700, 1000=0,21000, 10000=0,17900 (USD); Mount: Surface Mount; Case/Package: 0603; Case Code (Imperial): 0603; Color: Green; Case Code (Metric): 1608; Packaging: Cut Tape; Lens Transparency: Clear; Length: 1.6mm; Width: 0.8mm; Height: 0.95mm; ComponentLink1URL: http://www.mouser.com/ds/2/216/APTD1608LZGCK-535846.pdf?src-supplier=Mouser; ComponentLink1Description: http://www.mouser.com/ds/2/216/APTD1608LZGCK-535846.pdf?src-supplier=Mouser; ComponentLink2URL: http://www.kingbrightusa.com/images/catalog/SPEC/APTD1608LZGCK.pdf?src-supplier=Digi-Key; ComponentLink2Description: http://www.kingbrightusa.com/images/catalog/SPEC/APTD1608LZGCK.pdf?src-supplier=Digi-Key; Supplier Part Number 1: 604-APTD1608LZGCK
R6 = RT0603DRE07320RL: High Precision-High Stability Chip Resistor Thin Film 0603 320Ohm 0.5% Paper T/R; Manufacturer: Yageo; Max Power Dissipation: 100mW; Temperature Coefficient: 50ppm/°C; Supplier 1: Mouser; Manufacturer Part Number: RT0603DRE07320RL; RoHS: Yes; Category: Chip SMD Resistors; Stock 1: 3704; Pricing 1: 1=0,14000, 10=0,07400, 50=0,07400, 100=0,02600, 1000=0,01900, 10000=0,01200 (USD); Case/Package: 0603; Min Operating Temperature: -55°C; Max Operating Temperature: 155°C; Resistance: 320R; Tolerance: 0.5%; Resistor Type: Thin Film; Packaging: Tape and Reel; Number of Terminations: 2; ComponentLink1URL: http://www.yageo.com/documents/recent/PYu-RT_1-to-0.01_RoHS_L_9.pdf?src-supplier=Digi-Key; ComponentLink1Description: http://www.yageo.com/documents/recent/PYu-RT_1-to-0.01_RoHS_L_9.pdf?src-supplier=Digi-Key; Supplier Part Number 1: 603-RT0603DRE07320RL
R7 = ESR03EZPF1001: as R5 on sheet [03] - DAC; Supplier 1: Mouser; Manufacturer: Rohm; Manufacturer Part Number: ESR03EZPF1001; RoHS: Yes; Category: Chip SMD Resistors; Stock 1: 87852; Pricing 1: 1=0,13000, 10=0,11100, 50=0,11100, 100=0,04400, 1000=0,01700, 10000=0,01100 (USD); Case/Package: 0603; Case Code (Metric): 1608; Case Code (Imperial): 0603; Min Operating Temperature: -55°C; Max Operating Temperature: 155°C; Resistor Type: Thick Film; Number of Terminations: 2; Features: Automotive AEC-Q200; Package Quantity: 1; Power Rating: 250mW; Packaging: Tape and Reel; Length: 0.063inch; Width: 0.031inch; Height: 0.022inch; Lead Free: Lead Free; ComponentLink1URL: https://datasheet.ciiva.com/2469/esr-2469712.pdf?src-supplier=Digi-Key; ComponentLink1Description: https://datasheet.ciiva.com/2469/esr-2469712.pdf?src-supplier=Digi-Key; ComponentLink2URL: https://datasheet.ciiva.com/2469/esr-2469713.pdf?src-supplier=Digi-Key; ComponentLink2Description: https://datasheet.ciiva.com/2469/esr-2469713.pdf?src-supplier=Digi-Key; ComponentLink3URL: https://datasheet.ciiva.com/2469/esr-2469714.pdf?src-supplier=Digi-Key; ComponentLink3Description: https://datasheet.ciiva.com/2469/esr-2469714.pdf?src-supplier=Digi-Key; Supplier Part Number 1: 755-ESR03EZPF1001
S1-S3 = B3U-1000P: SWITCH TACTILE SPST-NO 0.05A 12V; Manufacturer: Omron; Mechanical Life: 200000Cycles; Operating Force: 1.5N; Throw Configuration: SPST; Current Rating: 50mA; Contact Resistance: 100mR; Illumination Type: Non-Illuminated,Illuminated; Switch Travel: 0.15mm; Switch Function: Off-Mom; Actuator Type: Standard; Actuator Length: 0.4mm; Ratings: Dust Proof,IP40; Supplier 1: Mouser; Manufacturer Part Number: B3U-1000P; RoHS: Yes; Category: Tactile Switches; Stock 1: 33691; Pricing 1: 1=0,92000, 10=0,79900, 50=0,79900, 100=0,64500, 1000=0,53800, 10000=0,44100 (USD); Mount: Surface Mount; Weight: 0.000776oz; Contact Material: Silver; Min Operating Temperature: -25°C; Max Operating Temperature: 70°C; Packaging: Tape and Reel; Voltage Rating (DC): 12V; Package Quantity: 1; Max Current Rating: 50mA; Termination: SMD/SMT; Orientation: Straight; Max Voltage Rating (DC): 12V; Electrical Life: 200000Cycles; Insulation Resistance: 100MR; Contact Current Rating: 50mA; Length: 4mm; Width: 3mm; Height: 1.2mm; Depth: 2.5mm; REACH SVHC: Unknown; Lead Free: Lead Free; ComponentLink1URL: https://datasheet.ciiva.com/26917/getdatasheetpartid-552554-26917552.pdf?src-supplier=Verical; ComponentLink1Description: https://datasheet.ciiva.com/26917/getdatasheetpartid-552554-26917552.pdf?src-supplier=Verical; ComponentLink2URL: https://datasheet.ciiva.com/22696/1685550-22696214.pdf?src-supplier=Element14; ComponentLink2Description: https://datasheet.ciiva.com/22696/1685550-22696214.pdf?src-supplier=Element14; ComponentLink3URL: https://datasheet.ciiva.com/1532/1685550-1532680.pdf?src-supplier=Element14; ComponentLink3Description: https://datasheet.ciiva.com/1532/1685550-1532680.pdf?src-supplier=Element14; ComponentLink4URL: https://datasheet.ciiva.com/1634/1685550-1634396.pdf?src-supplier=Farnell; ComponentLink4Description: https://datasheet.ciiva.com/1634/1685550-1634396.pdf?src-supplier=Farnell; ComponentLink5URL: https://datasheet.ciiva.com/14142/b3u-eng-datasheet-14142540.pdf?src-supplier=Distrelec; ComponentLink5Description: https://datasheet.ciiva.com/14142/b3u-eng-datasheet-14142540.pdf?src-supplier=Distrelec; ComponentLink6URL: https://datasheet.ciiva.com/2900/b3u-1110-2900029.pdf?src-supplier=Digi-Key; ComponentLink6Description: https://datasheet.ciiva.com/2900/b3u-1110-2900029.pdf?src-supplier=Digi-Key; ComponentLink7URL: https://datasheet.ciiva.com/16155/en-b3u-16155021.pdf?src-supplier=Onlinecomponents.com; ComponentLink7Description: https://datasheet.ciiva.com/16155/en-b3u-16155021.pdf?src-supplier=Onlinecomponents.com; ComponentLink8URL: https://datasheet.ciiva.com/2900/b3u-1110-2900030.pdf?src-supplier=Digi-Key; ComponentLink8Description: https://datasheet.ciiva.com/2900/b3u-1110-2900030.pdf?src-supplier=Digi-Key; ComponentLink9URL: https://datasheet.ciiva.com/16862/70176037-16862846.pdf?src-supplier=Allied+Electronics; ComponentLink9Description: https://datasheet.ciiva.com/16862/70176037-16862846.pdf?src-supplier=Allied+Electronics; ComponentLink10URL: https://datasheet.ciiva.com/2900/b3u-1110-2900031.pdf?src-supplier=Digi-Key; ComponentLink10Description: https://datasheet.ciiva.com/2900/b3u-1110-2900031.pdf?src-supplier=Digi-Key; Supplier Part Number 1: 653-B3U-1000P
S4 = JS102011SAQN: Slide Switch, JS Series, SPDT, Right Angle, SMD, 100 mA ;RoHS Compliant: Yes; Manufacturer: ITT C&K; Actuator Material: Nylon,Polyamide; Max Voltage Rating (DC): 6V; Max Current Rating: 300mA; Contact Resistance: 70mR; Electrical Life: 5000Cycles; Illumination Type: Non-Illuminated; Switch Travel: 2mm; Switch Function: On-On; Actuator Type: Standard; Supplier 1: Mouser; Manufacturer Part Number: JS102011SAQN; RoHS: Yes; Category: Slide Switches; Stock 1: 8122; Pricing 1: 1=0,51000, 10=0,51000, 50=0,47600, 100=0,46200, 1000=0,31600, 10000=0,29200 (USD); Mount: Surface Mount; Case/Package: 100; Contact Material: Copper Alloy,Copper,Silver; Contact Plating: Silver; Housing Material: Nylon; Min Operating Temperature: -40°C; Max Operating Temperature: 85°C; Throw Configuration: SPDT; Termination: Gull Wing; Packaging: Tape and Reel; Voltage Rating (DC): 6V; Package Quantity: 1; Current Rating: 300mA; Contact Current Rating: 300mA; Orientation: Right Angle; Length: 9mm; Actuator Length: 2mm; Radiation Hardening: No; REACH SVHC: No SVHC; Lead Free: Lead Free; ComponentLink1URL: https://datasheet.ciiva.com/1532/js-9dec14-1532400.pdf?src-supplier=Element14; ComponentLink1Description: https://datasheet.ciiva.com/1532/js-9dec14-1532400.pdf?src-supplier=Element14; ComponentLink2URL: https://datasheet.ciiva.com/16442/js102011saqn-16442775.pdf?src-supplier=Future+Electronics; ComponentLink2Description: https://datasheet.ciiva.com/16442/js102011saqn-16442775.pdf?src-supplier=Future+Electronics; ComponentLink3URL: https://datasheet.ciiva.com/5279/js-1nov12-221285-5279564.pdf?src-supplier=Mouser; ComponentLink3Description: https://datasheet.ciiva.com/5279/js-1nov12-221285-5279564.pdf?src-supplier=Mouser; ComponentLink4URL: https://datasheet.ciiva.com/18147/getdatasheetpartid-313004-18147207.pdf?src-supplier=Verical; ComponentLink4Description: https://datasheet.ciiva.com/18147/getdatasheetpartid-313004-18147207.pdf?src-supplier=Verical; ComponentLink5URL: https://datasheet.ciiva.com/2889/js-9dec14-2889130.pdf?src-supplier=Digi-Key; ComponentLink5Description: https://datasheet.ciiva.com/2889/js-9dec14-2889130.pdf?src-supplier=Digi-Key; ComponentLink6URL: https://datasheet.ciiva.com/8625/js-9dec14-8625466.pdf?src-supplier=Avnet; ComponentLink6Description: https://datasheet.ciiva.com/8625/js-9dec14-8625466.pdf?src-supplier=Avnet; ComponentLink7URL: https://datasheet.ciiva.com/2889/js-9dec14-2889131.pdf?src-supplier=Digi-Key; ComponentLink7Description: https://datasheet.ciiva.com/2889/js-9dec14-2889131.pdf?src-supplier=Digi-Key; ComponentLink8URL: https://datasheet.ciiva.com/2889/js-9dec14-2889132.pdf?src-supplier=Digi-Key; ComponentLink8Description: https://datasheet.ciiva.com/2889/js-9dec14-2889132.pdf?src-supplier=Digi-Key; ComponentLink9URL: https://datasheet.ciiva.com/16174/js-3nov11-16174349.pdf?src-supplier=Onlinecomponents.com; ComponentLink9Description: https://datasheet.ciiva.com/16174/js-3nov11-16174349.pdf?src-supplier=Onlinecomponents.com; Supplier Part Number 1: 611-JS102011SAQN

## Nets that join several sheets
+3.3V: [03] - DAC (7 pins), [04] - CONNECTORS (J1.41 VDD3.3.1), [05] - BUTTONS AND SWITCHES (S4.1)
+5V: [03] - DAC (C5.2 U2.7), [04] - CONNECTORS (J1.43 VDD5.1)
AGND: [03] - DAC (9 pins), [04] - CONNECTORS (J4.1 T1.1)
GND: [03] - DAC (5 pins), [04] - CONNECTORS (9 pins), [05] - BUTTONS AND SWITCHES (5 pins)
LEDA2: [04] - CONNECTORS (J1.8), [05] - BUTTONS AND SWITCHES (R7.1)
LEDC2: [04] - CONNECTORS (J1.7), [05] - BUTTONS AND SWITCHES (R7.2)
NetCVBS_1: [03] - DAC (CVBS.1 R1.2), [04] - CONNECTORS (J4.2)
NetR6_2: [03] - DAC (U1.6), [05] - BUTTONS AND SWITCHES (R6.2 S4.2)
P10: [04] - CONNECTORS (J1.25), [05] - BUTTONS AND SWITCHES (S1.1)
P11: [04] - CONNECTORS (J1.24), [05] - BUTTONS AND SWITCHES (S2.1)
P12: [04] - CONNECTORS (J1.23), [05] - BUTTONS AND SWITCHES (S3.1)
TVCLK: [03] - DAC (U1.9), [04] - CONNECTORS (J1.26 TVCLK.1)
TVDATA0: [03] - DAC (U1.11), [04] - CONNECTORS (J1.37 TVD0.1)
TVDATA1: [03] - DAC (U1.12), [04] - CONNECTORS (J1.36 TVD1.1)
TVDATA2: [03] - DAC (U1.13), [04] - CONNECTORS (J1.35 TVD2.1)
TVDATA3: [03] - DAC (U1.14), [04] - CONNECTORS (J1.34 TVD3.1)
TVDATA4: [03] - DAC (U1.15), [04] - CONNECTORS (J1.33 TVD4.1)
TVDATA5: [03] - DAC (U1.16), [04] - CONNECTORS (J1.32 TVD5.1)
TVDATA6: [03] - DAC (U1.17), [04] - CONNECTORS (J1.31 TVD6.1)
TVDATA7: [03] - DAC (U1.18), [04] - CONNECTORS (J1.30 TVD7.1)
TVDATA8: [03] - DAC (U1.19), [04] - CONNECTORS (J1.29 TVD8.1)
TVDATA9: [03] - DAC (U1.20), [04] - CONNECTORS (J1.27 TVD9.1)